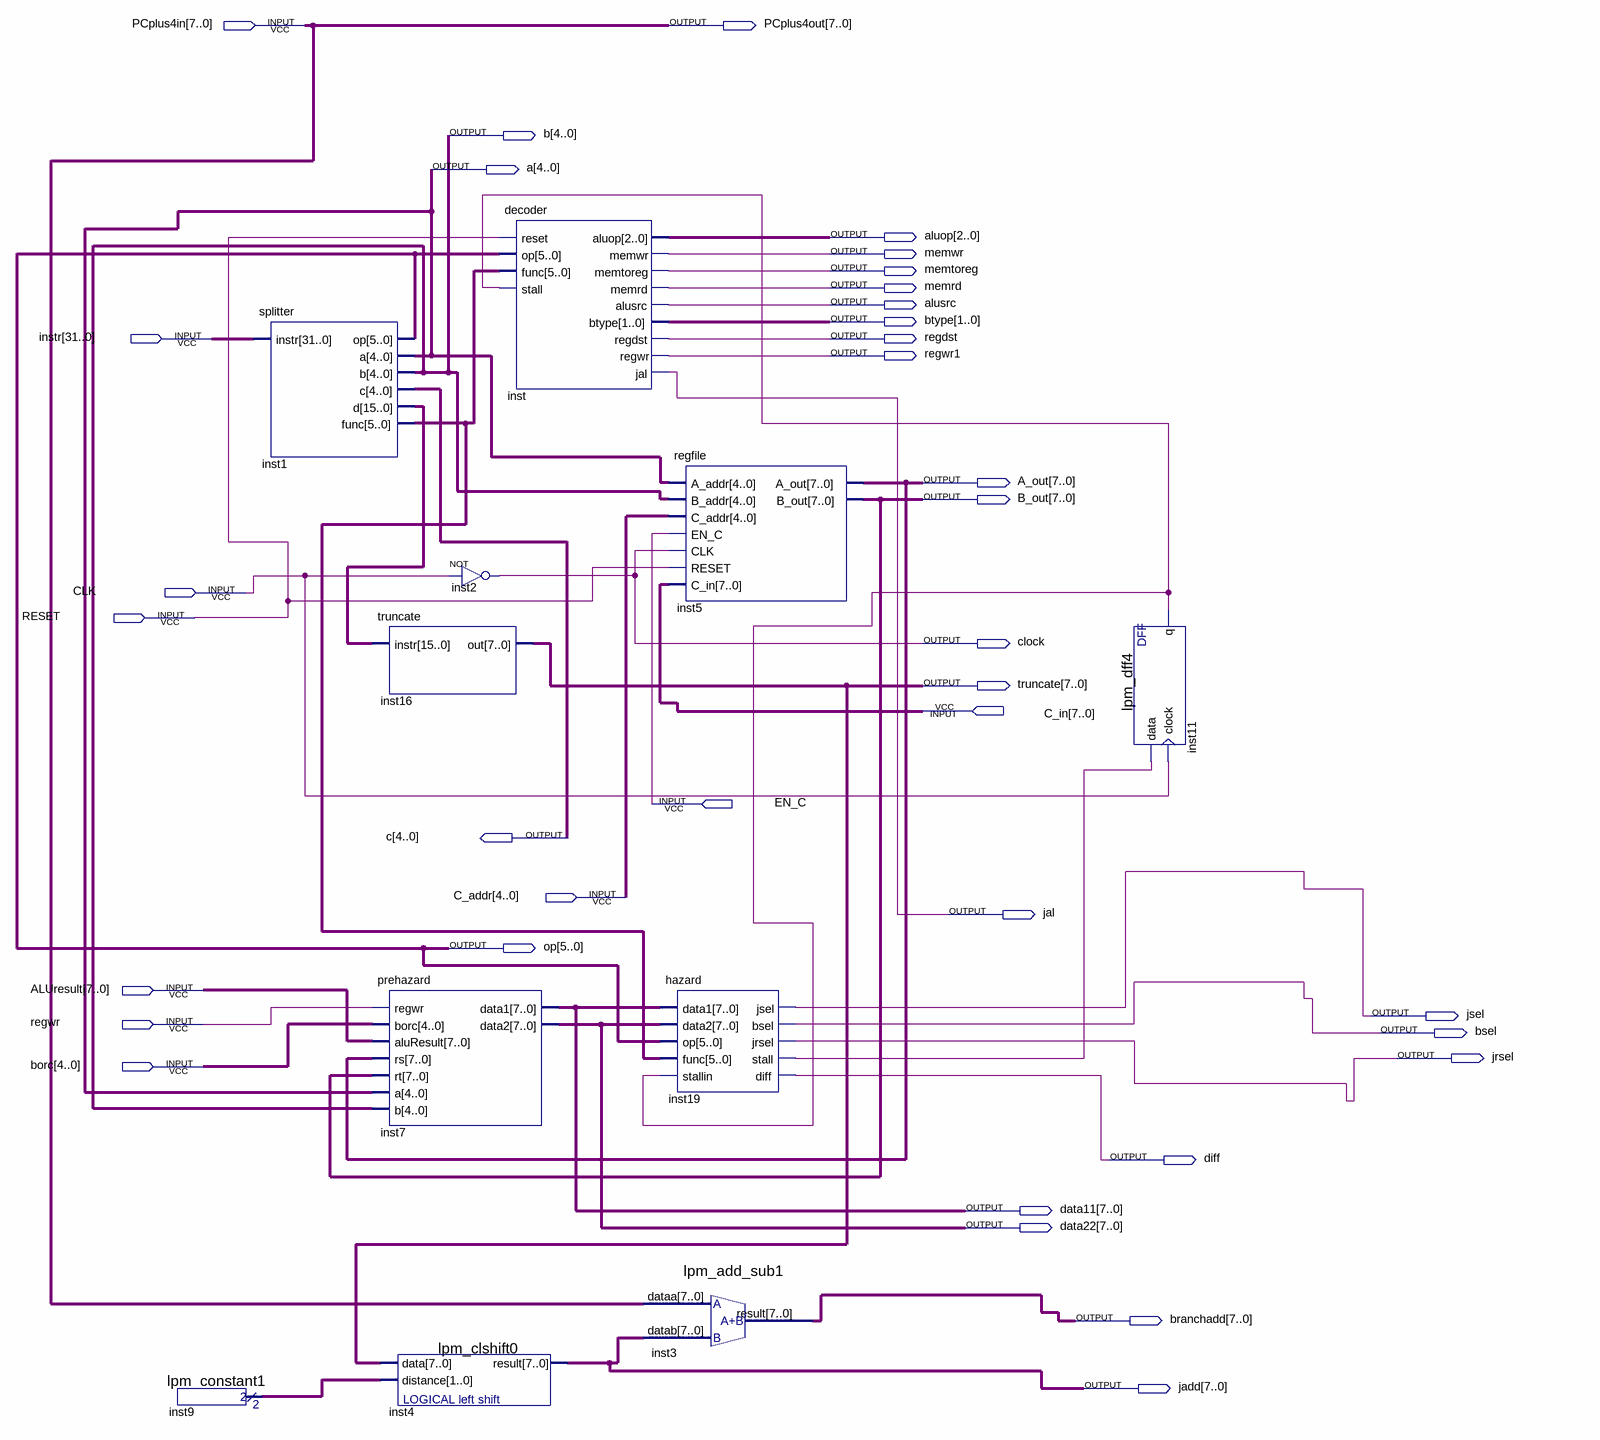
[diagram p0: schematic sheet]
// Quartus schematic regfilepipe.bdf as structural Verilog: 11 symbols, 36 pins
module regfilepipe (
  input  [7:0] PCplus4in,
  input  [31:0] instr,
  input  CLK,
  input  RESET,
  input  [7:0] C_in,
  input  EN_C,
  input  [4:0] C_addr,
  input  [7:0] ALUresult,
  input  regwr,
  input  [4:0] borc,
  output [7:0] PCplus4out,
  output [4:0] b,
  output [4:0] a,
  output [2:0] aluop,
  output memwr,
  output memtoreg,
  output memrd,
  output alusrc,
  output [1:0] btype,
  output regdst,
  output regwr1,
  output [7:0] A_out,
  output [7:0] B_out,
  output clock,
  output [7:0] truncate,
  output [4:0] c,
  output jal,
  output [5:0] op,
  output jsel,
  output bsel,
  output jrsel,
  output diff,
  output [7:0] data11,
  output [7:0] data22,
  output [7:0] branchadd,
  output [7:0] jadd
);

  wire inst11_q, inst19_stall;
  wire [1:0] inst9_result;
  wire [5:0] inst1_func;
  wire [15:0] inst1_d;

  lpm_constant1 inst9 (.result(inst9_result));
  splitter inst1 (.instr(instr), .op(op), .a(a), .b(b), .c(c), .d(inst1_d), .func(inst1_func));
  truncate inst16 (.instr(inst1_d), .out(truncate));
  prehazard inst7 (
    .regwr(regwr), .borc(borc), .aluResult(ALUresult), .rs(A_out), .rt(B_out), .a(a), .b(b), .data1(data11),
    .data2(data22));
  lpm_clshift0 inst4 (.data(truncate), .distance(inst9_result), .result(jadd));
  not inst2 (clock, CLK);
  decoder inst (
    .reset(RESET), .op(op), .func(inst1_func), .stall(inst11_q), .aluop(aluop), .memwr(memwr),
    .memtoreg(memtoreg), .memrd(memrd), .alusrc(alusrc), .btype(btype), .regdst(regdst), .regwr(regwr1),
    .jal(jal));
  regfile inst5 (
    .A_addr(a), .B_addr(b), .C_addr(C_addr), .EN_C(EN_C), .CLK(clock), .RESET(RESET), .C_in(C_in),
    .A_out(A_out), .B_out(B_out));
  hazard inst19 (
    .data1(data11), .data2(data22), .op(op), .func(inst1_func), .stallin(inst11_q), .jsel(jsel), .bsel(bsel),
    .jrsel(jrsel), .stall(inst19_stall), .diff(diff));
  lpm_add_sub1 inst3 (.dataa(PCplus4in), .datab(jadd), .result(branchadd));
  lpm_dff4 inst11 (.data(inst19_stall), .clock(CLK), .q(inst11_q));

  assign PCplus4out = PCplus4in;
endmodule
